# EAGLE design MEMS-preamp_v04 (EAGLE 8.0.1)
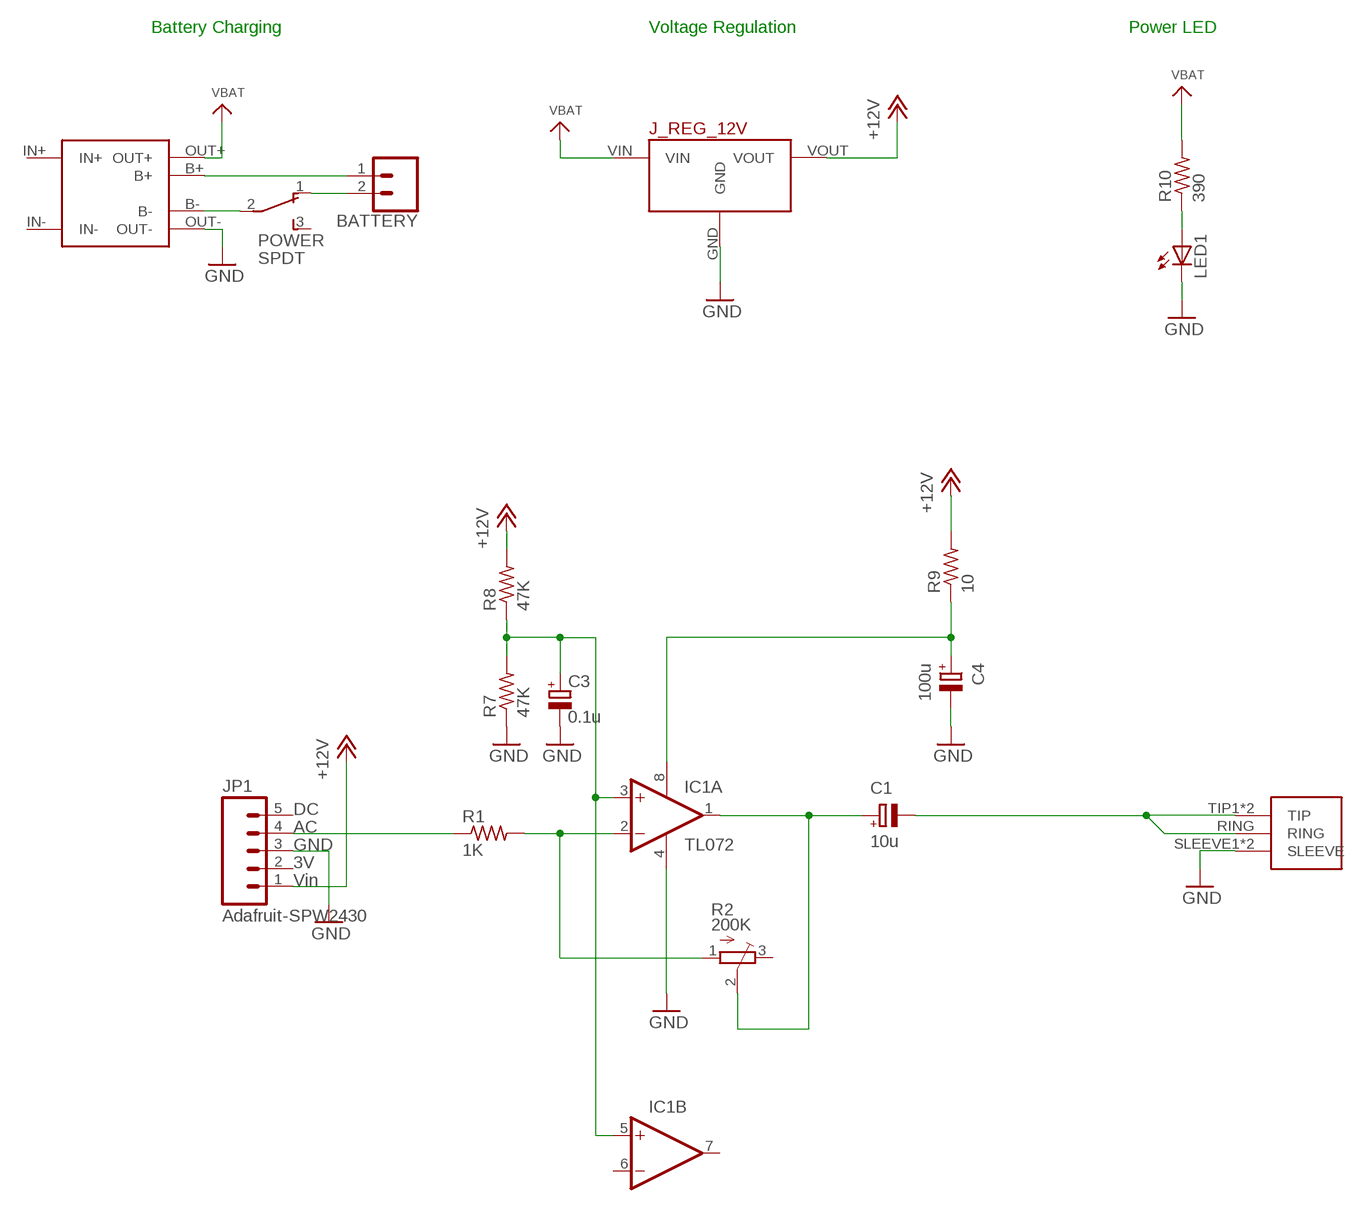
[diagram p0: schematic, sheet 1]

## Parts
BATTERY  CONN_02LOCK  [1X02_LOCK]
C1  10u  CPOL-EUE2.5-5  [E2,5-5]
C3  0.1u  CPOL-EUE2.5-5  [E2,5-5]
C4  100u  CPOL-EUE2.5-5  [E2,5-5]
IC1  OPA2134PA  [DIL08]
J_REG_12V  POLOLU_VOLTAGE_REGULATORS_3PIN  [POLOLU_5V-12V_STEPUP_U3V12F5-U3V12F12]
JP1  Adafruit-SPW2430  M05LOCK  [1X05_LOCK]
LED1  LED3MM  [LED3MM]
POWER  SPDT  SWITCH_SPDTTE-CONNECT  [SWITCH_SPDT-TE-CONNECT]
R1  1K  R-US_0204/5  [0204/5]
R2  200K  TRIMPOT3386  [TRIM-3386]
R7  47K  R-US_0204/5  [0204/5]
R8  47K  R-US_0204/5  [0204/5]
R9  10  R-US_0204/5  [0204/5]
R10  390  R-US_0204/5  [0204/5]
U$1  1/8"-F-STEREO-PCB  [1/8"-F-STEREO-PCB]
USB-LIPO-CHARGER  TP4056-MODULE  [TP4056-LITHIUM-PROTECTED-MODULE]

## Nets
+12V: J_REG_12V.VOUT JP1.1 R8.2 R9.2
GND: C3.- C4.- IC1.4(A:V-) J_REG_12V.GND JP1.3 LED1.K(C) R7.1 U$1.SLEEVE1(SLEEVE) U$1.SLEEVE2(SLEEVE) USB-LIPO-CHARGER.OUT-
N$1: C4.+ IC1.8(A:V+) R9.1
N$2: BATTERY.2 POWER.1
N$3: JP1.4 R1.1
N$5: IC1.2(A:-IN) R1.2 R2.1(A)
N$7: C1.- U$1.RING U$1.TIP1(TIP) U$1.TIP2(TIP)
N$8: C3.+ IC1.3(A:+IN) IC1.5(B:+IN) R7.2 R8.1
N$9: C1.+ IC1.1(A:OUT) R2.2(S)
N$16: LED1.A R10.1
N$18: BATTERY.1 USB-LIPO-CHARGER.B+
N$19: POWER.2 USB-LIPO-CHARGER.B-
VBAT: J_REG_12V.VIN R10.2 USB-LIPO-CHARGER.OUT+
Unconnected: IC1.6(B:-IN) IC1.7(B:OUT) JP1.2 JP1.5 POWER.3 R2.3(E)

## Notes on the sheet
- Battery Charging | Voltage Regulation | Power LED

## Power pins joined to a net without a drawn wire
IN+: USB-LIPO-CHARGER.IN+
IN-: USB-LIPO-CHARGER.IN-

## Library data of the parts
BATTERY = SparkFun-Connectors:CONN_02: Multi connection point. Often used as Generic Header-pin footprint for 0.1 inch spaced/style header connections On any of the 0.1 inch spaced packages, you can populate with these: Break Away Headers - Straight <https://www.sparkfun.com/products/116> (PRT-00116) Break Away Male Headers - Right Angle <https://www.sparkfun.com/products/553> (PRT-00553) Female Headers <https://www.sparkfun.com/products/115> (PRT-00115) Break Away Headers - Machine Pin <https://www.sparkfun.com/products/117> (PRT-00117) Break Away Female Headers - Swiss Machine Pin <https://www.sparkfun.com/products/743> (PRT-00743) For SCREWTERMINALS and SPRING TERMINALS visit here: Screw Terimnals on SparkFun.com <https://www.sparkfun.com/search/results?term=Screw+Terminals> (5mm/3.5mm/2.54mm spacing) This device is also useful as a general connection point to wire up your design to another part of your project. Our various solder wires solder well into these plated through hole pads. Hook-Up Wire - Assortment (Stranded, 22 AWG) <https://www.sparkfun.com/products/11375> (PRT-11375) Hook-Up Wire - Assortment (Solid Core, 22 AWG) <https://www.sparkfun.com/products/11367> (PRT-11367) View the entire wire category on our website here <https://www.sparkfun.com/categories/141> Special notes: Molex polarized connector foot print use with: PRT-08233 with associated crimp pins and housings. 2.54_SCREWTERM for use with PRT-10571. 3.5mm Screw Terminal footprints for PRT-08084 5mm Screw Terminal footprints for use with PRT-08432
C1 C3 C4 = rcl:CPOL-EU: POLARIZED CAPACITOR, European symbol
IC1 = linear:OPA2*: Dual Operational Amplifier Low Power, Single-Supply, Rail-To-Rail Operational Amplifier Source: http://focus.ti.com/lit/ds/symlink/opa2345.pdf http://focus.ti.com .. opa241.pdf http://focus.ti.com/lit/ds/symlink/opa2134.pdf; IC_NAME: TL072
J_REG_12V = CMU-ArtFab:POLOLU_VOLTAGE_REGULATORS_3PIN: Polulu 5V Step-Up/Step-Down Voltage REgulator S7V7F5
JP1 = SparkFun-Connectors:M05: Header 5 Standard 5-pin 0.1" header. Use with straight break away headers (SKU : PRT-00116), right angle break away headers (PRT-00553), swiss pins (PRT-00743), machine pins (PRT-00117), and female headers (PRT-00115). Molex polarized connector foot print use with SKU : PRT-08230 with associated crimp pins and housings.; CON1: Vin; CON2: 3V; CON3: GND; CON4: AC; CON5: DC
LED1 = led:LED: LED OSRAM: - CHIPLED LG R971, LG N971, LY N971, LG Q971, LY Q971, LO R971, LY R971 LH N974, LH R974 LS Q976, LO Q976, LY Q976 LO Q996 - Hyper CHIPLED LW Q18S LB Q993, LB Q99A, LB R99A - SideLED LS A670, LO A670, LY A670, LG A670, LP A670 LB A673, LV A673, LT A673, LW A673 LH A674 LY A675 LS A676, LA A676, LO A676, LY A676, LW A676 LS A679, LY A679, LG A679 - Hyper Micro SIDELED® LS Y876, LA Y876, LO Y876, LY Y876 LT Y87S - SmartLED LW L88C, LW L88S LB L89C, LB L89S, LG L890 LS L89K, LO L89K, LY L89K LS L896, LA L896, LO L896, LY L896 - TOPLED LS T670, LO T670, LY T670, LG T670, LP T670 LSG T670, LSP T670, LSY T670, LOP T670, LYG T670 LG T671, LOG T671, LSG T671 LB T673, LV T673, LT T673, LW T673 LH T674 LS T676, LA T676, LO T676, LY T676, LB T676, LH T676, LSB T676, LW T676 LB T67C, LV T67C, LT T67C, LS T67K, LO T67K, LY T67K, LW E67C LS E67B, LA E67B, LO E67B, LY E67B, LB E67C, LV E67C, LT E67C LW T67C LS T679, LY T679, LG T679 LS T770, LO T770, LY T770, LG T770, LP T770 LB T773, LV T773, LT T773, LW T773 LH T774 LS E675, LA E675, LY E675, LS T675 LS T776, LA T776, LO T776, LY T776, LB T776 LHGB T686 LT T68C, LB T68C - Hyper Mini TOPLED® LB M676 - Mini TOPLED Santana® LG M470 LS M47K, LO M47K, LY M47K Source: http://www.osram.convergy.de LUXEON: - LUMILED® LXK2-PW12-R00, LXK2-PW12-S00, LXK2-PW14-U00, LXK2-PW14-V00 LXK2-PM12-R00, LXK2-PM12-S00, LXK2-PM14-U00 LXK2-PE12-Q00, LXK2-PE12-R00, LXK2-PE12-S00, LXK2-PE14-T00, LXK2-PE14-U00 LXK2-PB12-K00, LXK2-PB12-L00, LXK2-PB12-M00, LXK2-PB14-N00, LXK2-PB14-P00, LXK2-PB14-Q00 LXK2-PR12-L00, LXK2-PR12-M00, LXK2-PR14-Q00, LXK2-PR14-R00 LXK2-PD12-Q00, LXK2-PD12-R00, LXK2-PD12-S00 LXK2-PH12-R00, LXK2-PH12-S00 LXK2-PL12-P00, LXK2-PL12-Q00, LXK2-PL12-R00 Source: www.luxeon.com KINGBRIGHT: KA-3528ASYC Source: www.kingbright.com
POWER = CMU-ArtFab:SWITCH_SPDT
R1 R7-R10 = CMU-ArtFab:R-US_: RESISTOR, American symbol
R2 = adafruit:TRIMPOT: SMT trimmer potentiometer part number TC33X http://www.ladyada.net/library/eagle
U$1 = CMU-ArtFab:1/8"-F-STEREO-PCB
USB-LIPO-CHARGER = CMU-ArtFab:TP4056-MODULE

## Board
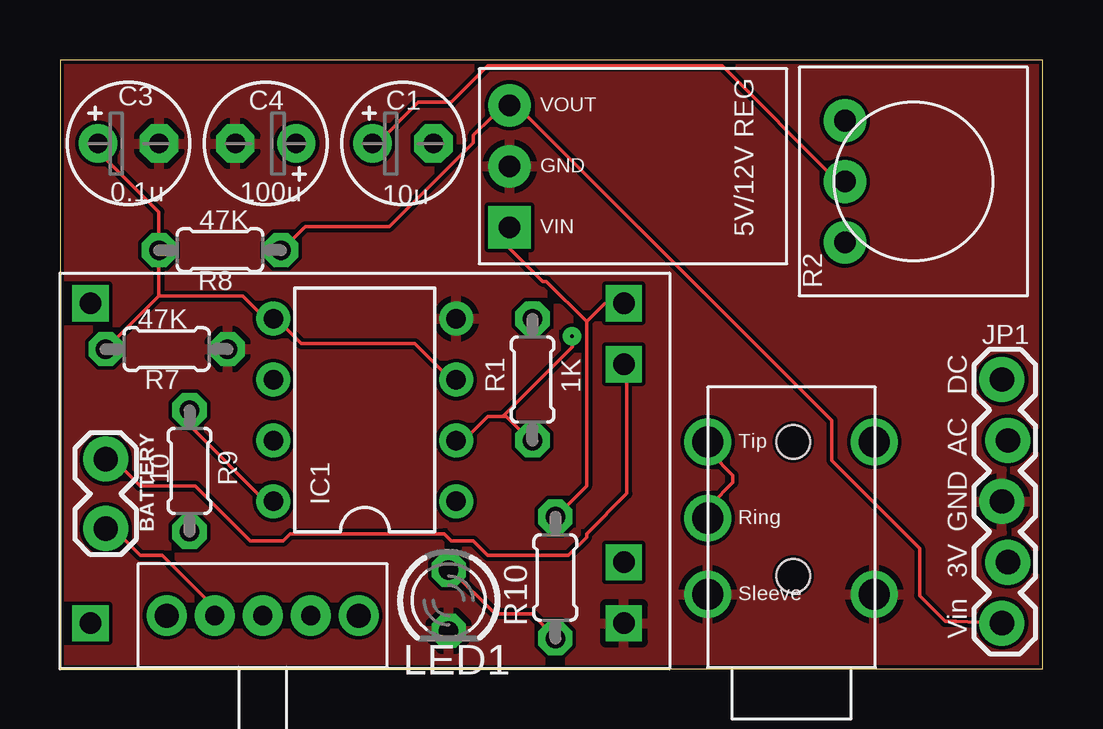
[diagram p1: board, top side]
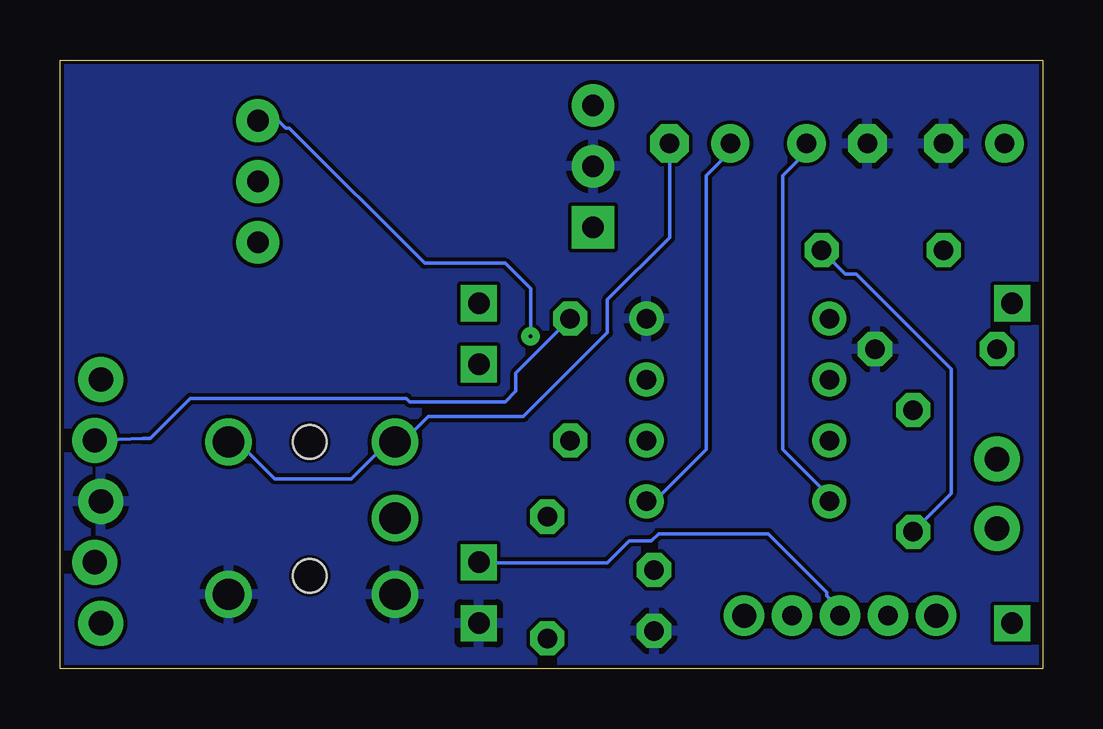
[diagram p2: board, bottom side, seen from below]

Size 40.95 x 25.39 mm. Coordinates in mm from the lower left corner, seen from the top.
Outline: 0,0 40.95,0 40.95,25.39 0,25.39 0,0
Copper layers (1*16): Top 0.035mm / dielectric 1.5mm / Bottom 0.035mm
Design rules "default *": minimum track width 6mil, minimum drill 6mil, track to track 6mil, track to pad 6mil, pad to pad 6mil, via to via 6mil, smd to smd 6mil, copper to edge 6mil, drill to drill 6mil, minimum pad ring 12mil, minimum via ring 12mil, stop-mask expansion 4mil, vias tented up to drill 0mil, thermal gap 10mil

### Footprints (pad centres in the part's own frame; a part is rotated, then mirrored left to right if it is on the bottom)
1X02_LOCK = drill 1.016 pad 1.88: 1 -0.178,0; 2 2.718,0
E2,5-5 = drill 0.813 pad 1.6: + -1.27,0 | drill 0.813 pad 1.6 octagon: - 1.27,0
DIL08 = drill 0.813 pad 1.27: 1 -3.81,-3.81; 2 -1.27,-3.81; 3 1.27,-3.81; 4 3.81,-3.81; 5 3.81,3.81; 6 1.27,3.81; 7 -1.27,3.81; 8 -3.81,3.81
POLOLU_5V-12V_STEPUP_U3V12F5-U3V12F12 = drill 0.9 pad 1.778: GND 0,-6.35; VOUT -2.54,-6.35 | drill 0.9 pad 1.778 square: VIN 2.54,-6.35
1X05_LOCK = drill 1.016 pad 1.88: 1 0,0.127; 2 2.54,-0.127; 3 5.08,0.127; 4 7.62,-0.127; 5 10.16,0.127
LED3MM = drill 0.813 octagon: A -1.27,0; K 1.27,0
SWITCH_SPDT-TE-CONNECT = drill 0.8 pad 1.676: 1 2,0; 2 4,0; 3 6,0 | drill 1 pad 1.676: MOUNT1 0,0; MOUNT2 8,0
0204/5 = drill 0.813 octagon: 1 -2.54,0; 2 2.54,0
TRIM-3386 = drill 0.9 pad 1.778: 1 -2.54,-2.857; 2 0,-2.857; 3 2.54,-2.857
1/8"-F-STEREO-PCB = drill 1.3: RING 5.461,0; SLEEVE1 8.636,6.934; SLEEVE2 8.636,0; TIP1 2.286,6.934; TIP2 2.286,0 | hole 1.4: 2.286,3.556; 7.874,3.556
TP4056-LITHIUM-PROTECTED-MODULE = drill 0.9 square: B+ 10.795,4.445; B- 10.795,-3.81; IN+ -11.43,6.985; IN- -11.43,-6.35; OUT+ 10.795,6.985; OUT- 10.795,-6.35

### Placement (x,y rotation side)
BATTERY  1.91,8.57 270 top
C1  14.29,21.91 0 top
C3  2.86,21.91 0 top
C4  8.57,21.91 180 top
IC1  12.7,10.79 90 top
J_REG_12V  25.08,20.95 270 top
JP1  39.37,1.91 90 top
LED1  16.19,2.86 270 top
POWER  4.45,2.22 0 top
R1  19.68,12.06 270 top
R2  35.56,20.32 270 top
R7  4.45,13.34 180 top
R8  6.67,17.46 0 top
R9  5.4,8.26 270 top
R10  20.64,3.81 90 top
U$1  26.99,11.75 270 top
USB-LIPO-CHARGER  12.7,8.26 0 top

### Tracks (layer width: path | path; a pad name or v marks a point on that pad's centre or on a via)
+12V
  Top 0.152: R8.2 9.3,17.53 10.21,18.44 13.72,18.44 17.22,21.95 17.22,22.25 17.98,23.01 18.14,23.01 18.59,23.47 J_REG_12V.VOUT 18.75,23.47 19.05,23.47 32.16,10.36 32.16,8.69 35.81,5.03 35.81,3.05 36.88,1.98 37.34,1.98 JP1.1
  Bottom 0.152: R9.2 5.33,5.79 3.81,7.32 3.81,12.5 7.77,16.46 8.23,16.46 9.14,17.37 R8.2
GND
  pour Bottom: -2.54,-2.54 43.18,-2.54 43.18,27.94 -2.54,27.94
  pour Top: -1.27,26.67 41.91,26.67 41.91,-1.27 -1.27,-1.27
N$1
  Top 0.152: IC1.8 8.84,7.01 8.53,7.01 5.49,10.06 5.49,10.67 R9.1
  Bottom 0.152: C4.+ 9.91,21.79 9.91,21.49 10.82,20.57 10.82,9.14 8.99,7.32 8.99,7.01 IC1.8
N$2
  Top 0.152: POWER.1 6.4,2.29 6.4,2.59 4.27,4.72 3.35,4.72 2.29,5.79 1.98,5.79 BATTERY.2
N$3
  Bottom 0.152: R1.1 21.95,12.34 21.95,11.58 22.4,11.12 26.36,11.12 26.52,11.28 35.51,11.28 37.19,9.6 37.49,9.6 JP1.4
N$5  (via drill 0.15)
  Top 0.152: 18.44,10.52 18.59,10.52 19.66,9.45 R1.2 | 18.44,10.52 17.83,10.52 16.92,9.6 16.61,9.6 IC1.2 | v21.34,13.87 21.34,13.41 18.44,10.52
  Bottom 0.152: R2.1 31.85,22.86 31.55,22.55 31.39,22.55 25.76,16.92 22.4,16.92 21.34,15.85 v21.34,13.87
N$7
  Top 0.152: U$1.RING 27.13,6.4 27.13,6.86 28.04,7.77 28.04,8.08 27.13,8.99 27.13,9.45 U$1.TIP2
  Bottom 0.152: C1.- 15.54,21.79 15.54,17.98 18.14,15.39 18.14,14.02 21.64,10.52 25.6,10.52 26.52,9.6 26.98,9.6 U$1.TIP2 27.13,9.6 28.8,7.92 32,7.92 33.53,9.45 33.83,9.45 U$1.TIP1
N$8
  Top 0.152: 4.12,15.54 R7.2 | 4.12,15.54 4.12,17.37 R8.1 4.12,17.53 4.12,19.05 1.68,21.49 1.68,21.79 C3.+ | 4.12,15.54 7.62,15.54 8.53,14.63 8.84,14.63 IC1.5 8.99,14.63 10.06,13.56 14.78,13.56 16.15,12.19 16.46,12.19 IC1.3
N$9
  Top 0.152: R2.2 32.61,20.42 32.31,20.42 27.58,25.15 17.83,25.15 16.31,23.62 14.94,23.62 13.11,21.79 C1.+
  Bottom 0.152: IC1.1 16.46,7.01 16.15,7.01 14.02,9.14 14.02,20.57 13.11,21.49 13.11,21.79 C1.+
N$16
  Top 0.152: LED1.A 16.31,4.12 18.14,2.29 19.66,2.29 20.57,1.37 R10.1
N$18
  Top 0.152: USB-LIPO-CHARGER.B+ 23.62,12.65 23.62,7.32 21.95,5.64 21.95,5.49 21.18,4.72 17.83,4.72 17.22,5.33 16.31,5.33 16,5.64 9.6,5.64 9.3,5.33 7.92,5.33 5.64,7.62 3.35,7.62 2.29,8.69 1.98,8.69 BATTERY.1
N$19
  Bottom 0.152: USB-LIPO-CHARGER.B- 23.47,4.42 18.14,4.42 17.22,5.33 16.31,5.33 16,5.64 11.43,5.64 8.99,3.2 8.99,3.05 8.53,2.59 8.53,2.29 POWER.2
VBAT
  Top 0.152: 21.95,14.48 21.95,7.62 20.73,6.4 R10.2 | 21.95,14.48 22.71,15.24 USB-LIPO-CHARGER.OUT+ | 21.95,14.48 20.27,16.15 20.12,16.15 18.75,17.53 18.75,18.29 J_REG_12V.VIN